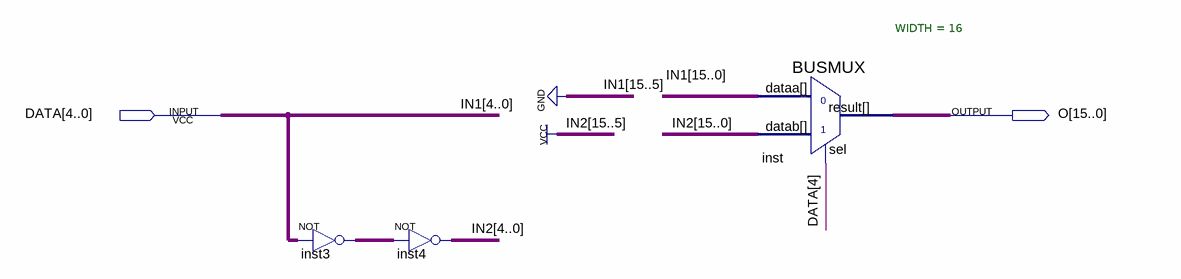
[diagram p0: schematic sheet]
// Quartus schematic SIGNEXTEND.bdf as structural Verilog: 3 symbols, 2 pins
module SIGNEXTEND (
  input  [4:0] DATA,
  output [15:0] O
);

  wire [4:0] IN2, inst3_out;

  assign inst3_out = ~DATA;  // NOT inst3, 5 bits wide
  assign IN2 = ~inst3_out;  // NOT inst4, 5 bits wide
  BUSMUX #(.WIDTH(16)) inst (.datab({{11{1'b1}}, IN2}), .sel(DATA[4]), .dataa({{11{1'b0}}, DATA}), .result(O));

  // Other names for the same wires on the sheet: IN1[4:0] = DATA
endmodule
